# Altium schematic sheet ADSR Schematic.SchDoc
size A
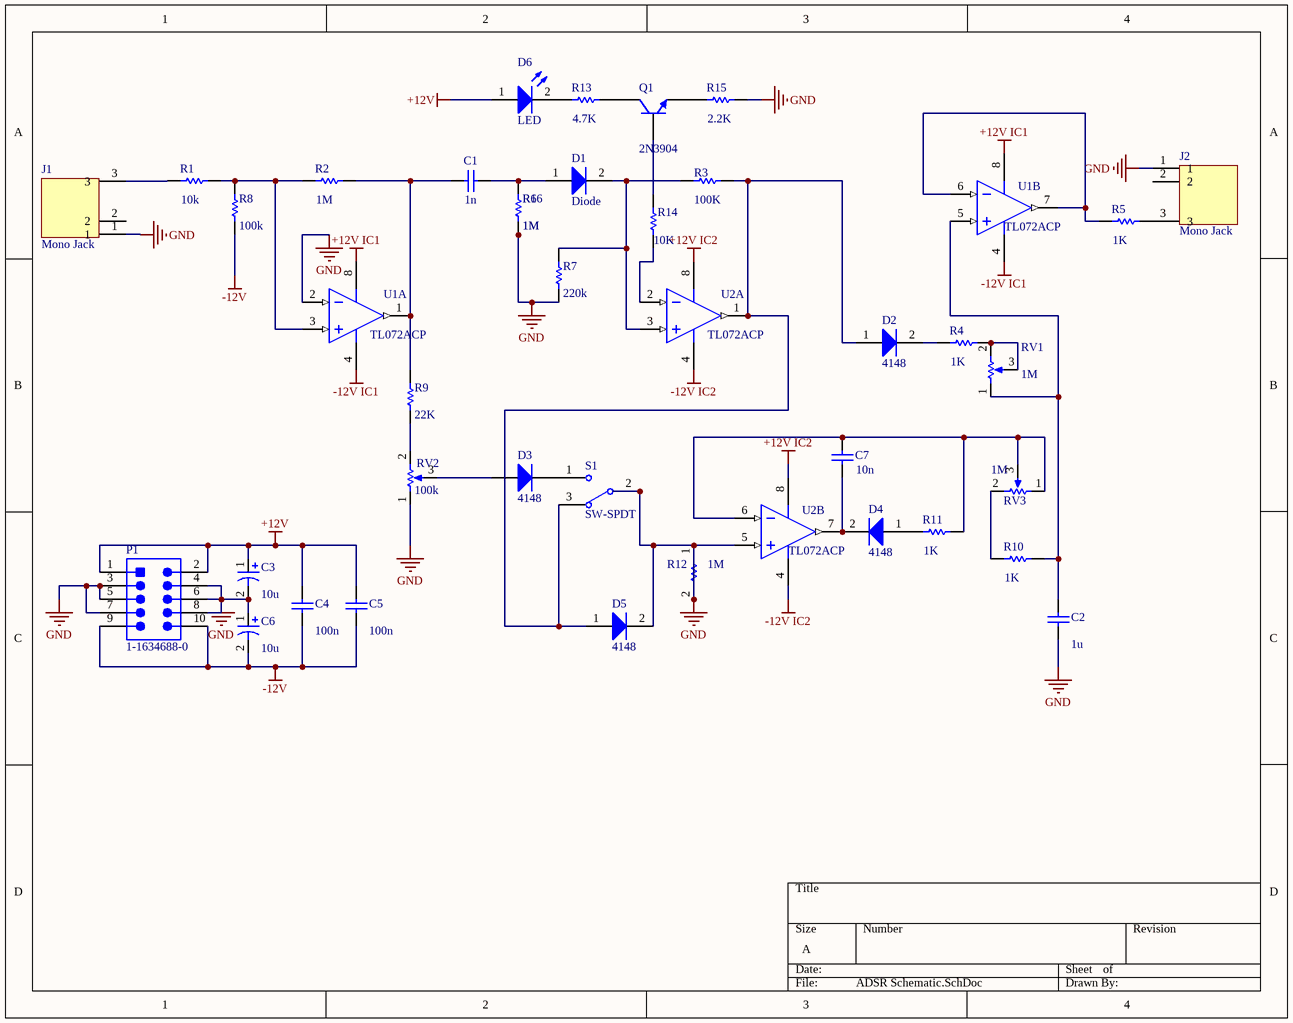
[diagram p0: ADSR Schematic.SchDoc]

## Parts
C1  value 1n  [Ceramic_Cap]  (hidden comment: Cap)
C2  value 1u  [Ceramic_Cap]  (hidden comment: Cap)
C3  value 10u  [Electrolytic_Cap]  (hidden comment: Cap Pol1)
C4  value 100n  [Ceramic_Cap]  (hidden comment: Cap)
C5  value 100n  [Ceramic_Cap]  (hidden comment: Cap)
C6  value 10u  [Electrolytic_Cap]  (hidden comment: Cap Pol1)
C7  value 10n  [Ceramic_Cap]  (hidden comment: Cap)
D1  Diode  [DIODE]
D2  4148  [DIODE]
D3  4148  [DIODE]
D4  4148  [DIODE]
D5  4148  [DIODE]
D6  LED  [DIODE]
J1  Mono Jack  [MONO_Jack]
J2  Mono Jack  [MONO_Jack]
P1  1-1634688-0  [TECO-1-1634688-0-10_V]
Q1  2N3904  [TO-92A]
R1  value 10k  [R_SMT]  (hidden comment: Res1)
R2  value 1M  [R_SMT]  (hidden comment: Res1)
R3  value 100K  [R_SMT]  (hidden comment: Res1)
R4  value 1K  [R_SMT]  (hidden comment: Res1)
R5  value 1K  [R_SMT]  (hidden comment: Res1)
R6  value 1M  [AXIAL-0.3]  (hidden comment: Res1)
R7  value 220k  [R_SMT]  (hidden comment: Res1)
R8  value 100k  [R_SMT]  (hidden comment: Res1)
R9  value 22K  [R_SMT]  (hidden comment: Res1)
R10  value 1K  [R_SMT]  (hidden comment: Res1)
R11  value 1K  [R_SMT]  (hidden comment: Res1)
R12  value 1M  [R_SMT]  (hidden comment: Res1)
R13  value 4.7K  [R_SMT]  (hidden comment: Res1)
R14  value 10K  [R_SMT]  (hidden comment: Res1)
R15  value 2.2K  [R_SMT]  (hidden comment: Res1)
R16  value 1M  [R_SMT]  (hidden comment: Res1)
RV1  value 1M  [POT]  (hidden comment: RPot)
RV2  value 100k  [POT]  (hidden comment: RPot)
RV3  value 1M  [POT]  (hidden comment: RPot)
S1  SW-SPDT  [TL36WW15050]
U1  TL072ACP  [P0008A]  (parts A,B of 2)
U2  TL072ACP  [P0008A]  (parts A,B of 2)

## Nets
+12V: C3.1 C4.1 C5.1 D6.1(A) P1.1 P1.2
+12V IC1: U1.8(VCC+)
+12V IC2: U2.8(VCC+)
-12V: C4.2 C5.2 C6.2 P1.9 P1.10 R8.1
-12V IC1: U1.4(VCC-)
-12V IC2: U2.4(VCC-)
GND: C2.2 C3.2 C6.1 D5.2(K) J1.1 J2.1 P1.3 P1.4 P1.5 P1.6 P1.7 P1.8 R6.2 R7.1 R12.1 R12.2 R15.2 R16.2 RV2.1(TOP) S1.2 U1.2(IN1-) U2.5(IN2+)
NetC1_1: C1.1 R2.2 R9.1 U1.1(OUT1)
NetC1_2: C1.2 D1.1(A) R6.1 R16.1
NetC2_1: C2.1 R10.2 RV1.1(TOP) U1.5(IN2+)
NetC7_1: C7.1 D4.2(K) U2.7(OUT2)
NetC7_2: C7.2 R11.2 RV3.1(TOP) RV3.3(TAP) U2.6(IN2-)
NetD1_2: D1.2(K) R3.2 R7.2 U2.3(IN1+)
NetD2_1: D2.1(A) D5.1(A) R3.1 S1.3 U2.1(OUT1)
NetD2_2: D2.2(K) R4.2
NetD3_1: D3.1(A) RV2.3(TAP)
NetD3_2: D3.2(K) S1.1
NetD4_1: D4.1(A) R11.1
NetD6_2: D6.2(K) R13.1
NetJ1_3: J1.3 R1.1
NetJ2_3: J2.3 R5.2
NetQ1_1: Q1.1(E) R15.1
NetQ1_2: Q1.2(B) R14.1
NetQ1_3: Q1.3(C) R13.2
NetR1_2: R1.2 R2.1 R8.2 U1.3(IN1+)
NetR4_1: R4.1 RV1.2(BOT) RV1.3(TAP)
NetR5_1: R5.1 U1.6(IN2-) U1.7(OUT2)
NetR9_2: R9.2 RV2.2(BOT)
NetR10_1: R10.1 RV3.2(BOT)
NetR14_2: R14.2 U2.2(IN1-)

Not connected (* = marked no-connect by the designer): J1 2; J2 2

## Library data of the parts
C1 C2 C4 C5 C7 = Cap: Capacitor; Published: 8-Jun-2000; LatestRevisionDate: 17-Jul-2002; LatestRevisionNote: Re-released for DXP Platform.; PackageReference: RAD-0.3; Publisher: Altium Limited; PackageDescription: Radial Cap, Thru-Hole; 2 Leads; 0.3 in Pin Spacing
C3 C6 = Cap Pol1: Polarized Capacitor (Radial); Published: 8-Jun-2000; LatestRevisionDate: 17-Jul-2002; LatestRevisionNote: Re-released for DXP Platform.; PackageReference: RB7.6-15; Publisher: Altium Limited; PackageDescription: Polarized Capacitor (Radial); 2 Leads
D1-D5 = Diode: Default Diode; Published: 8-Jun-2000; LatestRevisionDate: 17-Jul-2002; LatestRevisionNote: Re-released for DXP Platform.; PackageVersion: Sep-1996; PackageReference: SMC; Publisher: Altium Limited; PackageDescription: DO-214-AB/SMC; 2 C-Bend Leads; Body 7.9 x 5.9 mm, inc. leads (LxW); Code_JEDEC: DO-214-AB
D6 = LED0: Typical INFRARED GaAs LED; Published: 8-Jun-2000; LatestRevisionDate: 08-Jul-2005; LatestRevisionNote: Mech Layer 1 removed.; PackageReference: LED-0; Publisher: Altium Limited; PackageDescription: LED; 2 Leads
J1 J2 = 4832.2211: Phone Connectors Audio Socket 3.5MM 2P SCR; Manufacturer: Schurter; Body Material: Metal; Shielding: Shielded; Number of Ports: 1; Max Voltage Rating (AC): 30V; Number of Contacts: 2; Gender: Female; Current Rating: 500mA; Supplier 1: Digi-Key; Manufacturer Part Number: 4832.2211; RoHS: Yes; Category: Audio / Video Connectors; Stock 1: 363; Pricing 1: 1=1.50000, 50=1.38500, 100=1.13400, 500=0.94200, 1000=0.93840 (USD); Mount: Through Hole,Panel; Case/Package: Metal; Weight: 0.077603oz; Contact Plating: Silver; Number of Terminals: 3; Material: Plastic; Min Operating Temperature: -20°C; Max Operating Temperature: 70°C; Packaging: Bulk; Termination: Solder; Orientation: Straight; Package Quantity: 500; Max Current Rating: 500mA; Diameter: 3.5mm; Length: 10.5mm; Depth: 9mm; REACH SVHC: No SVHC; ComponentLink1URL: https://datasheet.ciiva.com/25289/1580985-25289573.pdf?src-supplier=Newark; ComponentLink1Description: https://datasheet.ciiva.com/25289/1580985-25289573.pdf?src-supplier=Newark; ComponentLink2URL: https://datasheet.ciiva.com/12540/typ-4832-2211-58787-12540719.pdf?src-supplier=Mouser; ComponentLink2Description: https://datasheet.ciiva.com/12540/typ-4832-2211-58787-12540719.pdf?src-supplier=Mouser; ComponentLink3URL: https://datasheet.ciiva.com/1086/1580985-1086284.pdf?src-supplier=Element14; ComponentLink3Description: https://datasheet.ciiva.com/1086/1580985-1086284.pdf?src-supplier=Element14; Supplier Part Number 1: 486-3418-ND
P1 = CMP-2000-05854-1: Male Header, Pitch 2.54 mm, 2 x 5 Postion, Height 9.15 mm, Tail Length 3.2 mm, -40 to 105 degC, RoHS, Bulk; Manufacturer: TE Connectivity; No. of Rows: 2; SVHC: ToBeAdvised; Package Version: Rev. C2, 02/2011; No. of Contacts: 10Contacts; Pitch: 2.54mm; No. of Positions: 10; Contact Termination Type: ThroughHole; Package Description: 10-Pin Connector, Body 20.35 x 8.7 mm, Pitch 2.54 mm; Orientation: Straight; Gender: Header; Mounting Technology: ThroughHole; Product Range: -; PartNumber: 1-1634688-0; Datasheet Version: Rev. C2, 02/2011; Contact Material: Brass; Package URL: https://datasheet.ciiva.com/6831/eng-cd-1634688-c2-6831201.pdf; Package Reference: 1-1634688-0; Pitch Spacing: 2.54mm; Contact Plating: GoldPlatedContacts; Manufacturer URL: http://www.te.com/; Datasheet URL: https://datasheet.ciiva.com/6831/eng-cd-1634688-c2-6831201.pdf
Q1 = 2N3904: NPN General Purpose Amplifier; Published: 8-Jun-2000; LatestRevisionDate: 15-Jan-2003; LatestRevisionNote: PCB Footprint 'BCY-W3/D4.7' replaced; DatasheetVersion: 1997; PackageVersion: Sep-1998; PackageReference: TO-92A; Publisher: Altium Limited; PackageDescription: TO, Flat Index; 3 In-Line, Axial Leads; Body Dia. 4.5mm; Leads 0.51 x 0.48 mm (max); ComponentLink1Description: Manufacturer Link; ComponentLink1URL: http://www.fairchildsemi.com/; ComponentLink2Description: Datasheet; ComponentLink2URL: http://www.fairchildsemi.com/ds/2N%2F2N3904.pdf
R1-R16 = Res1: Resistor; Published: 8-Jun-2000; LatestRevisionDate: 17-Jul-2002; LatestRevisionNote: Re-released for DXP Platform.; PackageReference: AXIAL-0.3; Publisher: Altium Limited; PackageDescription: Axial Device, Thru-Hole; 2 Leads; 0.3 in Pin Spacing
RV1-RV3 = RPot: Potentiometer; Sim Note: Enter the Resistance value and the set point into parameter fields.; Set Position: 0.5; Published: 8-Jun-2000; LatestRevisionDate: 17-Jul-2002; LatestRevisionNote: Re-released for DXP Platform.; PackageReference: VR5; Publisher: Altium Limited; PackageDescription: Variable Resistor, Thru-Hole; 3 Leads
S1 = SW-SPDT: SPDT Subminiature Toggle Switch, Right Angle Mounting, Vertical Actuation; Published: 24-Mar-1999; LatestRevisionDate: 17-Dec-2003; LatestRevisionNote: Schematic revised, PCB Footprint replaced.; DatasheetVersion: 05-Dec-2000; PackageReference: TL36WW15050; Publisher: Altium Limited; PackageDescription: Switch; 4 Leads; ComponentLink1Description: Manufacturer Link; ComponentLink1URL: http://www.apem.com
U1 = TI-AMP-D6-2-8_D: Low-Noise JFET-Input Operational Amplifier, 7 to 36 V, 0 to 70 degC, 8-pin DIP (P8), Pb-Free (RoHS); Manufacturer: Texas Instruments; Iq per channel(Max)(mA): 2.5; Offset Drift(Typ)(uV/C): 18; CMRR(Min)(dB): 75; IIB(Max)(pA): 200; Total Supply Voltage(Max)(+5V is 5, +/-5V is 10): 36; GBW(Typ)(MHz): 3; Slew Rate(Typ)(V/us): 13; Vio (25C)(Max)(mV): 6; Rating: Catalog; Total Supply Voltage(Min)(+5V is 5, +/-5V is 10): 7; Sub Family: General Purpose Amplifier, High Supply Voltage Amplifier (>=30V); Number of Channels: 2; ComponentLink3URL: http://www.ti.com/litv/pdf/mpdi001b; Vn at 1kHz(Typ)(nV/rtHz): 18; ComponentLink1Description: Manufacturer URL; PackageVersion: 4040082/E, 04/2010; ComponentLink2URL: http://www.ti.com/lit/ds/symlink/tl072a.pdf; PackageReference: P0008A; PackageDescription: 8-Pin Plastic In-Line, Body 9.59 x 6.35 mm, Pitch 2.54 mm; DatasheetVersion: SLOS080J; Code_JEDEC: MS-001; ComponentLink3Description: Package Specification; ComponentLink2Description: Datasheet; PartNumber: TL072ACP; ComponentLink1URL: http://www.ti.com/; Mounting Technology: Through Hole; Eco-Plan: Pb-Free (RoHS)
U2 = CMP-0017-00929-2: Low-Noise JFET-Input Operational Amplifier, 7 to 36 V, 0 to 70 degC, 8-pin DIP (P8), Pb-Free (RoHS); Manufacturer: Texas Instruments; Iq per channel(Max)(mA): 2.5; Offset Drift(Typ)(uV/C): 18; CMRR(Min)(dB): 75; IIB(Max)(pA): 200; Total Supply Voltage(Max)(+5V is 5, +/-5V is 10): 36; GBW(Typ)(MHz): 3; Slew Rate(Typ)(V/us): 13; Vio (25C)(Max)(mV): 6; Rating: Catalog; Total Supply Voltage(Min)(+5V is 5, +/-5V is 10): 7; Sub Family: General Purpose Amplifier, High Supply Voltage Amplifier (>=30V); Number of Channels: 2; ComponentLink3URL: http://www.ti.com/litv/pdf/mpdi001b; Vn at 1kHz(Typ)(nV/rtHz): 18; ComponentLink1Description: Manufacturer URL; PackageVersion: 4040082/E, 04/2010; ComponentLink2URL: http://www.ti.com/lit/ds/symlink/tl072a.pdf; PackageReference: P0008A; PackageDescription: 8-Pin Plastic In-Line, Body 9.59 x 6.35 mm, Pitch 2.54 mm; DatasheetVersion: SLOS080J; Code_JEDEC: MS-001; ComponentLink3Description: Package Specification; ComponentLink2Description: Datasheet; PartNumber: TL072ACP; ComponentLink1URL: http://www.ti.com/; Mounting Technology: Through Hole; Eco-Plan: Pb-Free (RoHS)